# Altium schematic sheet ECG circuit.SchDoc
size A4
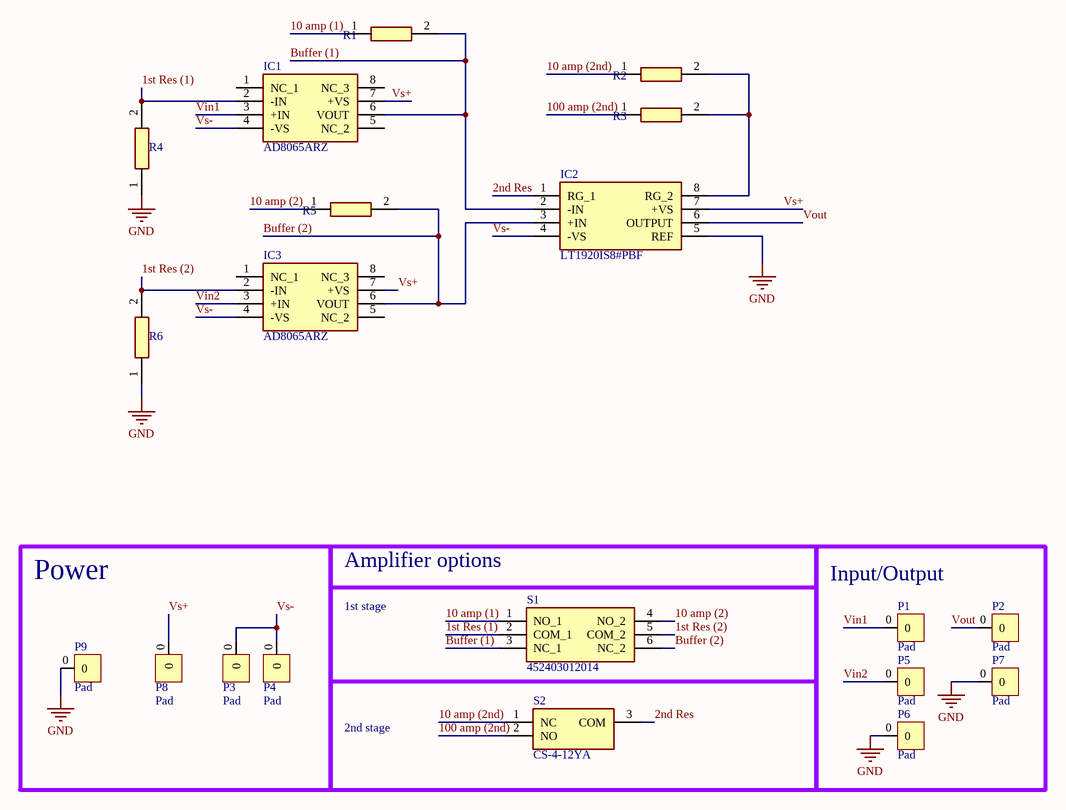
[diagram p0: ECG circuit.SchDoc]

## Parts
IC1  AD8065ARZ  [SOIC127P600X175-8N]
IC2  LT1920IS8#PBF  [SOIC127P599X175-8N]
IC3  AD8065ARZ  [SOIC127P600X175-8N]
P1  Pad  [Pad]
P2  Pad  [Pad]
P3  Pad  [Pad]
P4  Pad  [Pad]
P5  Pad  [Pad]
P6  Pad  [Pad]
P7  Pad  [Pad]
P8  Pad  [Pad]
P9  Pad  [Pad]
R1  CRF0805-FZ-R002ELF  [RESC2012X80N]  (value not drawn)
R2  CRF0805-FZ-R002ELF  [RESC2012X80N]  (value not drawn)
R3  CRF0805-FZ-R002ELF  [RESC2012X80N]  (value not drawn)
R4  CRF0805-FZ-R002ELF  [RESC2012X80N]  (value not drawn)
R5  CRF0805-FZ-R002ELF  [RESC2012X80N]  (value not drawn)
R6  CRF0805-FZ-R002ELF  [RESC2012X80N]  (value not drawn)
S1  452403012014  [452403012014]
S2  CS-4-12YA  [CS412YA]

## Blocks framed on the sheet
Power: P3 P4 P8 P9
Amplifier options: S1 S2
Input/Output: P1 P2 P5-P7

## Nets
GND: IC2.5(REF) P6.0 P7.0 P9.0 R4.1 R6.1
1st Res (1): IC1.2(-IN) R4.2 S1.2(COM_1)
1st Res (2): IC3.2(-IN) R6.2 S1.5(COM_2)
2nd Res: IC2.1(RG_1) S2.3(COM)
10 amp (1): R1.1 S1.1(NO_1)
10 amp (2): R5.1 S1.4(NO_2)
10 amp (2nd): R2.1 S2.1(NC)
100 amp (2nd): R3.1 S2.2(NO)
Buffer (1): IC1.6(VOUT) IC2.2(-IN) R1.2 S1.3(NC_1)
Buffer (2): IC2.3(+IN) IC3.6(VOUT) R5.2 S1.6(NC_2)
Vin1: IC1.3(+IN) P1.0
Vin2: IC3.3(+IN) P5.0
Vout: IC2.6(OUTPUT) P2.0
Vs+: IC1.7(+VS) IC2.7(+VS) IC3.7(+VS) P8.0
Vs-: IC1.4(-VS) IC2.4(-VS) IC3.4(-VS) P3.0 P4.0
NetIC2_8: IC2.8(RG_2) R2.2 R3.2

Not connected (* = marked no-connect by the designer): IC1 1(NC_1) 5(NC_2) 8(NC_3); IC3 1(NC_1) 5(NC_2) 8(NC_3)

## Notes on the sheet
- 1st stage
- 2nd stage

## Library data of the parts
IC1 IC3 = AD8065ARZ: Integrated Circuit; Manufacturer_Name: Analog Devices; Datasheet Link: https://datasheet.datasheetarchive.com/originals/distributors/Datasheets-1/DSA-2047.pdf; Height: 1.75mm; Manufacturer_Part_Number: AD8065ARZ; Mouser Part Number: 584-AD8065ARZ; Mouser Price/Stock: https://www.mouser.co.uk/ProductDetail/Analog-Devices/AD8065ARZ?qs=%2FtpEQrCGXCyXd34RglYLzQ%3D%3D; Arrow Part Number: AD8065ARZ; Arrow Price/Stock: https://www.arrow.com/en/products/ad8065arz/analog-devices?region=nac
IC2 = LT1920IS8#PBF: Integrated Circuit; Manufacturer_Name: Analog Devices; Datasheet Link: https://datasheet.datasheetarchive.com/originals/distributors/SFDatasheet-4/sf-00091026.pdf; Height: 1.752mm; Manufacturer_Part_Number: LT1920IS8#PBF; Mouser Part Number: 584-LT1920IS8#PBF; Mouser Price/Stock: https://www.mouser.co.uk/ProductDetail/Analog-Devices/LT1920IS8PBF?qs=ytflclh7QUWOSod6PqfjSg%3D%3D; Arrow Part Number: LT1920IS8#PBF; Arrow Price/Stock: https://www.arrow.com/en/products/lt1920is8pbf/analog-devices?region=nac
R1-R6 = CRF0805-FZ-R002ELF: Resistor; Manufacturer_Name: Bourns; Datasheet Link: https://www.bourns.com/docs/product-datasheets/CRF.pdf; Height: 0.8mm; Manufacturer_Part_Number: CRF0805-FZ-R002ELF; Mouser Part Number: 652-CRF0805FZR002ELF; Mouser Price/Stock: https://www.mouser.co.uk/ProductDetail/Bourns/CRF0805-FZ-R002ELF?qs=t7xnP681wgXcQ5vhBgw1Wg%3D%3D; Arrow Part Number: CRF0805-FZ-R002ELF; Arrow Price/Stock: https://www.arrow.com/en/products/crf0805-fz-r002elf/bourns?region=nac
S1 = 452403012014: Switch; Manufacturer_Name: Wurth Elektronik; Datasheet Link: https://katalog.we-online.de/em/datasheet/452403012014.pdf; Height: 3.3mm; Manufacturer_Part_Number: 452403012014; Mouser Part Number: 710-452403012014; Mouser Price/Stock: https://www.mouser.co.uk/ProductDetail/Wurth-Elektronik/452403012014?qs=DvsTirrhYfOi0QxHyAEO3w%3D%3D
S2 = CS-4-12YA: Switch; Manufacturer_Name: NIDEC COPAL; Datasheet Link: https://www.nidec-copal-electronics.com/j/product/detail/00000197/; Height: 2.6mm; Manufacturer_Part_Number: CS-4-12YA